# EAGLE schematic SingleInputThreeOutputConnection (EAGLE 7.3.0)
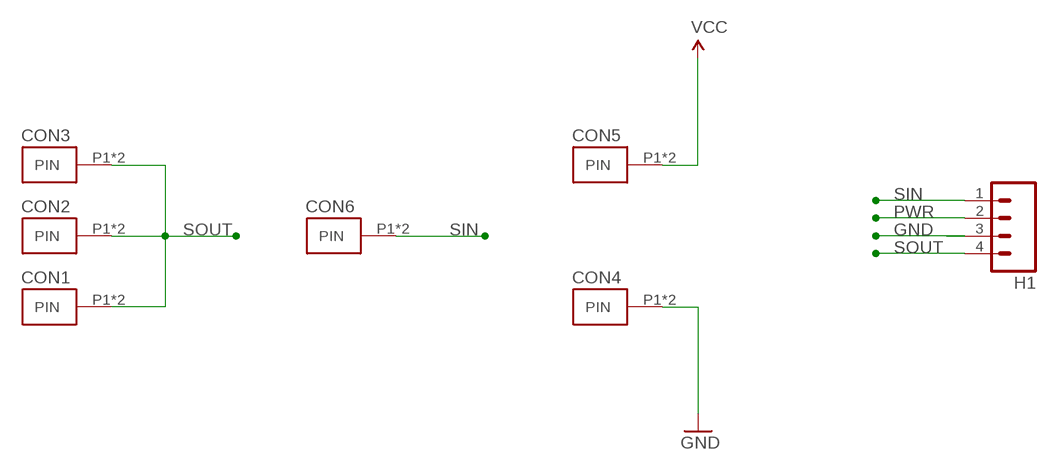
[diagram p0: schematic, sheet 1]

## Parts
CON1  SHIELD_FINGER0820  [SHIELD_FINGER_PKG]
CON2  SHIELD_FINGER0820  [SHIELD_FINGER_PKG]
CON3  SHIELD_FINGER0820  [SHIELD_FINGER_PKG]
CON4  SHIELD_FINGER0820  [SHIELD_FINGER_PKG]
CON5  SHIELD_FINGER0820  [SHIELD_FINGER_PKG]
CON6  SHIELD_FINGER0820  [SHIELD_FINGER_PKG]
H1  M04  [1X04_NO_HOLES]

## Nets
GND: CON4.P1(PIN) CON4.P2(PIN) H1.3
PWR: CON5.P1(PIN) CON5.P2(PIN) H1.2 ; supply symbol labelled VCC
SIN: CON6.P1(PIN) CON6.P2(PIN) H1.1
SOUT: CON1.P1(PIN) CON1.P2(PIN) CON2.P1(PIN) CON2.P2(PIN) CON3.P1(PIN) CON3.P2(PIN) H1.4

## Library data of the parts
CON1-CON6 = MakerShoe:SHIELD_FINGER
H1 = SparkFun-Connectors:M04: Header 4 Standard 4-pin 0.1" header. Use with straight break away headers (SKU : PRT-00116), right angle break away headers (PRT-00553), swiss pins (PRT-00743), machine pins (PRT-00117), and female headers (PRT-00115). Molex polarized connector foot print use with SKU : PRT-08231 with associated crimp pins and housings. 1MM SMD Version SKU: PRT-10208